# Altium schematic sheet PMS.SchDoc
size E
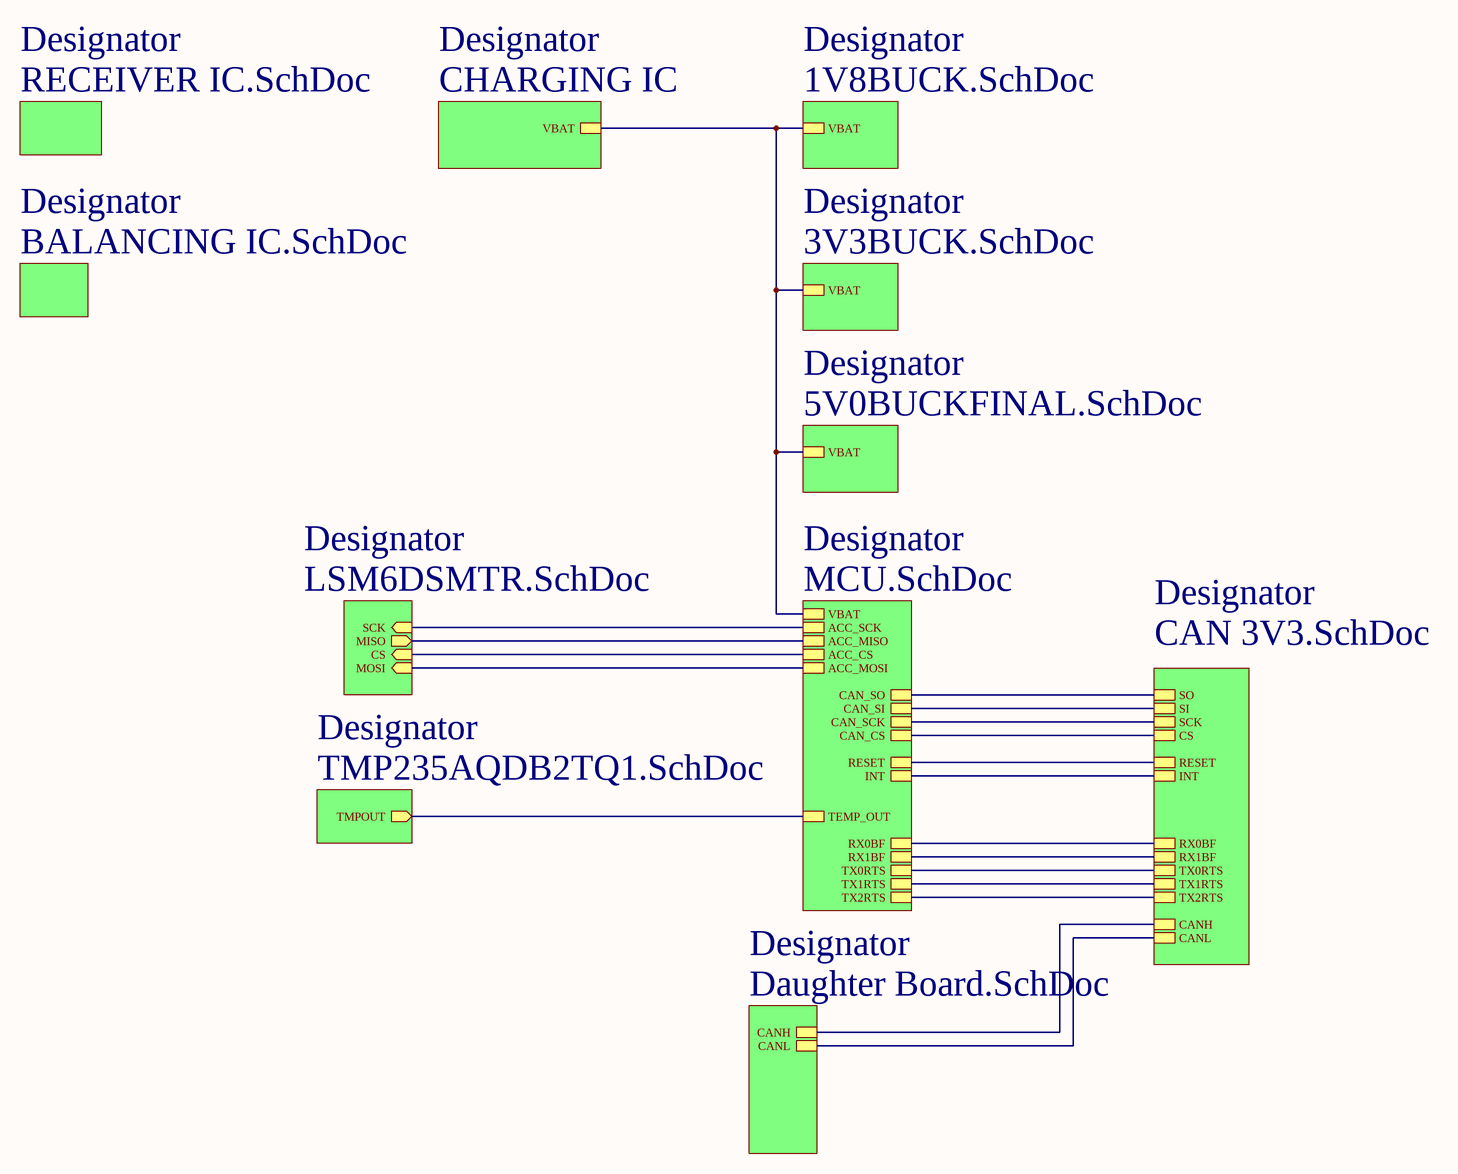
[diagram p0: PMS.SchDoc]

## Sub-sheets
Designator = CHARGING IC: VBAT
Designator = BALANCING IC.SchDoc: no entries
Designator = 1V8BUCK.SchDoc: VBAT
Designator = 3V3BUCK.SchDoc: VBAT
Designator = CAN 3V3.SchDoc: CS, TX2RTS, TX0RTS, TX1RTS, RX0BF, SCK, INT, CANH, RESET, SO, RX1BF, SI, CANL
Designator = RECEIVER IC.SchDoc: no entries
Designator = MCU.SchDoc: CAN_SCK, INT, CAN_CS, ACC_CS, TX2RTS, CAN_SO, TX1RTS, TX0RTS, CAN_SI, ACC_MISO, RX0BF, ACC_SCK, VBAT, ACC_MOSI, TEMP_OUT, RESET, RX1BF
Designator = TMP235AQDB2TQ1.SchDoc: TMPOUT (out)
Designator = LSM6DSMTR.SchDoc: SCK (in), MISO (out), CS (in), MOSI (in)
Designator = 5V0BUCKFINAL.SchDoc: VBAT
Designator = Daughter Board.SchDoc: CANL, CANH

## Nets
(unnamed): sheet Designator/VBAT, sheet Designator/VBAT, sheet Designator/VBAT, sheet Designator/VBAT, sheet Designator/VBAT
(unnamed): sheet Designator/CS, sheet Designator/CAN_CS
(unnamed): sheet Designator/TX2RTS, sheet Designator/TX2RTS
(unnamed): sheet Designator/TX0RTS, sheet Designator/TX0RTS
(unnamed): sheet Designator/TX1RTS, sheet Designator/TX1RTS
(unnamed): sheet Designator/RX0BF, sheet Designator/RX0BF
(unnamed): sheet Designator/SCK, sheet Designator/CAN_SCK
(unnamed): sheet Designator/INT, sheet Designator/INT
(unnamed): sheet Designator/CANH, sheet Designator/CANH
(unnamed): sheet Designator/RESET, sheet Designator/RESET
(unnamed): sheet Designator/SO, sheet Designator/CAN_SO
(unnamed): sheet Designator/RX1BF, sheet Designator/RX1BF
(unnamed): sheet Designator/SI, sheet Designator/CAN_SI
(unnamed): sheet Designator/CANL, sheet Designator/CANL
(unnamed): sheet Designator/ACC_CS, sheet Designator/CS
(unnamed): sheet Designator/ACC_MISO, sheet Designator/MISO
(unnamed): sheet Designator/ACC_SCK, sheet Designator/SCK
(unnamed): sheet Designator/ACC_MOSI, sheet Designator/MOSI
(unnamed): sheet Designator/TEMP_OUT, sheet Designator/TMPOUT